# EAGLE design ActiveElectrode (EAGLE 5.01)
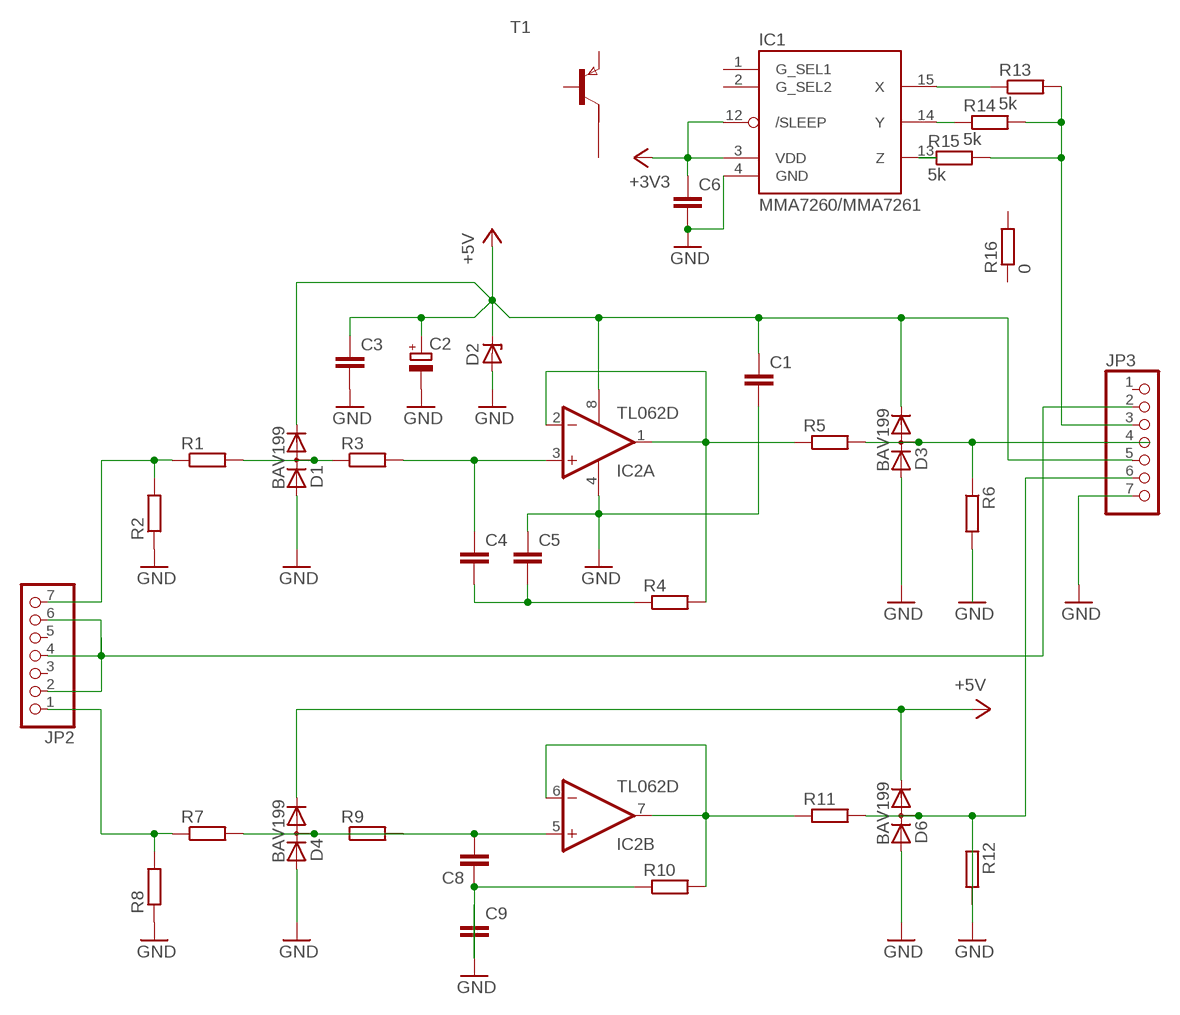
[diagram p0: schematic, sheet 1]

## Parts
C1  C-EUC0603  [C0603]
C2  CPOL-EUB/3528-21R  [B/3528-21R]
C3  C-EUC0603  [C0603]
C4  C-EUC0603  [C0603]
C5  C-EUC0603  [C0603]
C6  C-EUC0603  [C0603]
C8  C-EUC0603  [C0603]
C9  C-EUC0603  [C0603]
D1  BAV199  [SOT23]
D2  ZENER-DIODESOD80C  [SOD80C]
D3  BAV199  [SOT23]
D4  BAV199  [SOT23]
D6  BAV199  [SOT23]
IC1  MMA7260/MMA7261  [QFN16-HS]
IC2  TL062D  [SO08]
JP2  PINHD-1X7  [1X07]
JP3  PINHD-1X7  [1X07]
R1  R-EU_R0603  [R0603]
R2  R-EU_R0603  [R0603]
R3  R-EU_R0603  [R0603]
R4  R-EU_R0603  [R0603]
R5  R-EU_R0603  [R0603]
R6  R-EU_R0603  [R0603]
R7  R-EU_R0603  [R0603]
R8  R-EU_R0603  [R0603]
R9  R-EU_R0603  [R0603]
R10  R-EU_R0603  [R0603]
R11  R-EU_R0603  [R0603]
R12  R-EU_R0603  [R0603]
R13  5k  R-EU_R0603  [R0603]
R14  5k  R-EU_R0603  [R0603]
R15  5k  R-EU_R0603  [R0603]
R16  0  R-EU_M3216  [M3216]
T1  PNPSOT23-6  [SOT23-6]

## Nets
+3V3: C6.1 IC1.3(VDD) IC1.12(/SLEEP)
+5V: C1.1 C2.+ C3.1 D1.2(C) D2.C D3.2(C) D4.2(C) D6.2(C) IC2.8(P:V+) JP3.5
N$1: D1.3(AC) R1.2 R3.1
N$2: JP2.7 R1.1 R2.2
N$3: D3.3(AC) R5.2 R6.1
N$4: C4.1 IC2.3(A:+IN) R3.2
N$5: C4.2 C5.2 R4.1
N$6: IC2.1(A:OUT) IC2.2(A:-IN) R4.2 R5.1
N$7: C1.2 C2.- C3.2 C5.1 C6.2 C9.1 D1.1(A) D2.A D3.1(A) D4.1(A) D6.1(A) IC1.4(GND) IC2.4(P:V-) JP3.7 R2.1 R6.2 R8.1 R12.1 ; supply symbol labelled GND
N$8: D4.3(AC) R7.2 R9.2
N$9: C8.2 IC2.5(B:+IN) R9.1
N$10: C8.1 C9.2 R10.1
N$11: IC1.13(Z) R15.1
N$12: D6.3(AC) JP3.6 R11.2 R12.2
N$14: IC1.14(Y) R14.1
N$15: IC2.6(B:-IN) IC2.7(B:OUT) R10.2 R11.1
N$16: JP3.3 R13.2 R14.2 R15.2
N$17: IC1.15(X) R13.1
N$18: JP2.1 R7.1 R8.2
N$22: JP2.2 JP2.4 JP2.6 JP3.2
Unconnected: IC1.1(G_SEL1) IC1.2(G_SEL2) JP2.3 JP2.5 JP3.1 JP3.4 R16.1 R16.2 T1.1(C) T1.2(C1) T1.3(B) T1.4(E) T1.5(C2) T1.6(C3)

## Library data of the parts
C1 C3-C6 C8 C9 = rcl:C-EU: CAPACITOR, European symbol
C2 = rcl:CPOL-EU: POLARIZED CAPACITOR, European symbol
D1 D3 D4 D6 = diode:BAV199: DIODE low-leakage double diode
D2 = diode:ZENER-DIODE: Z-Diode
IC1 = mma7260_7261:MMA7260/MMA7261
IC2 = linear:TL062: OP AMP
JP2 JP3 = pinhead:PINHD-1X7: PIN HEADER
R1-R16 = rcl:R-EU_: RESISTOR, European symbol
T1 = zetex:PNPSOT23-6: PNP TRANSISTOR

## Board
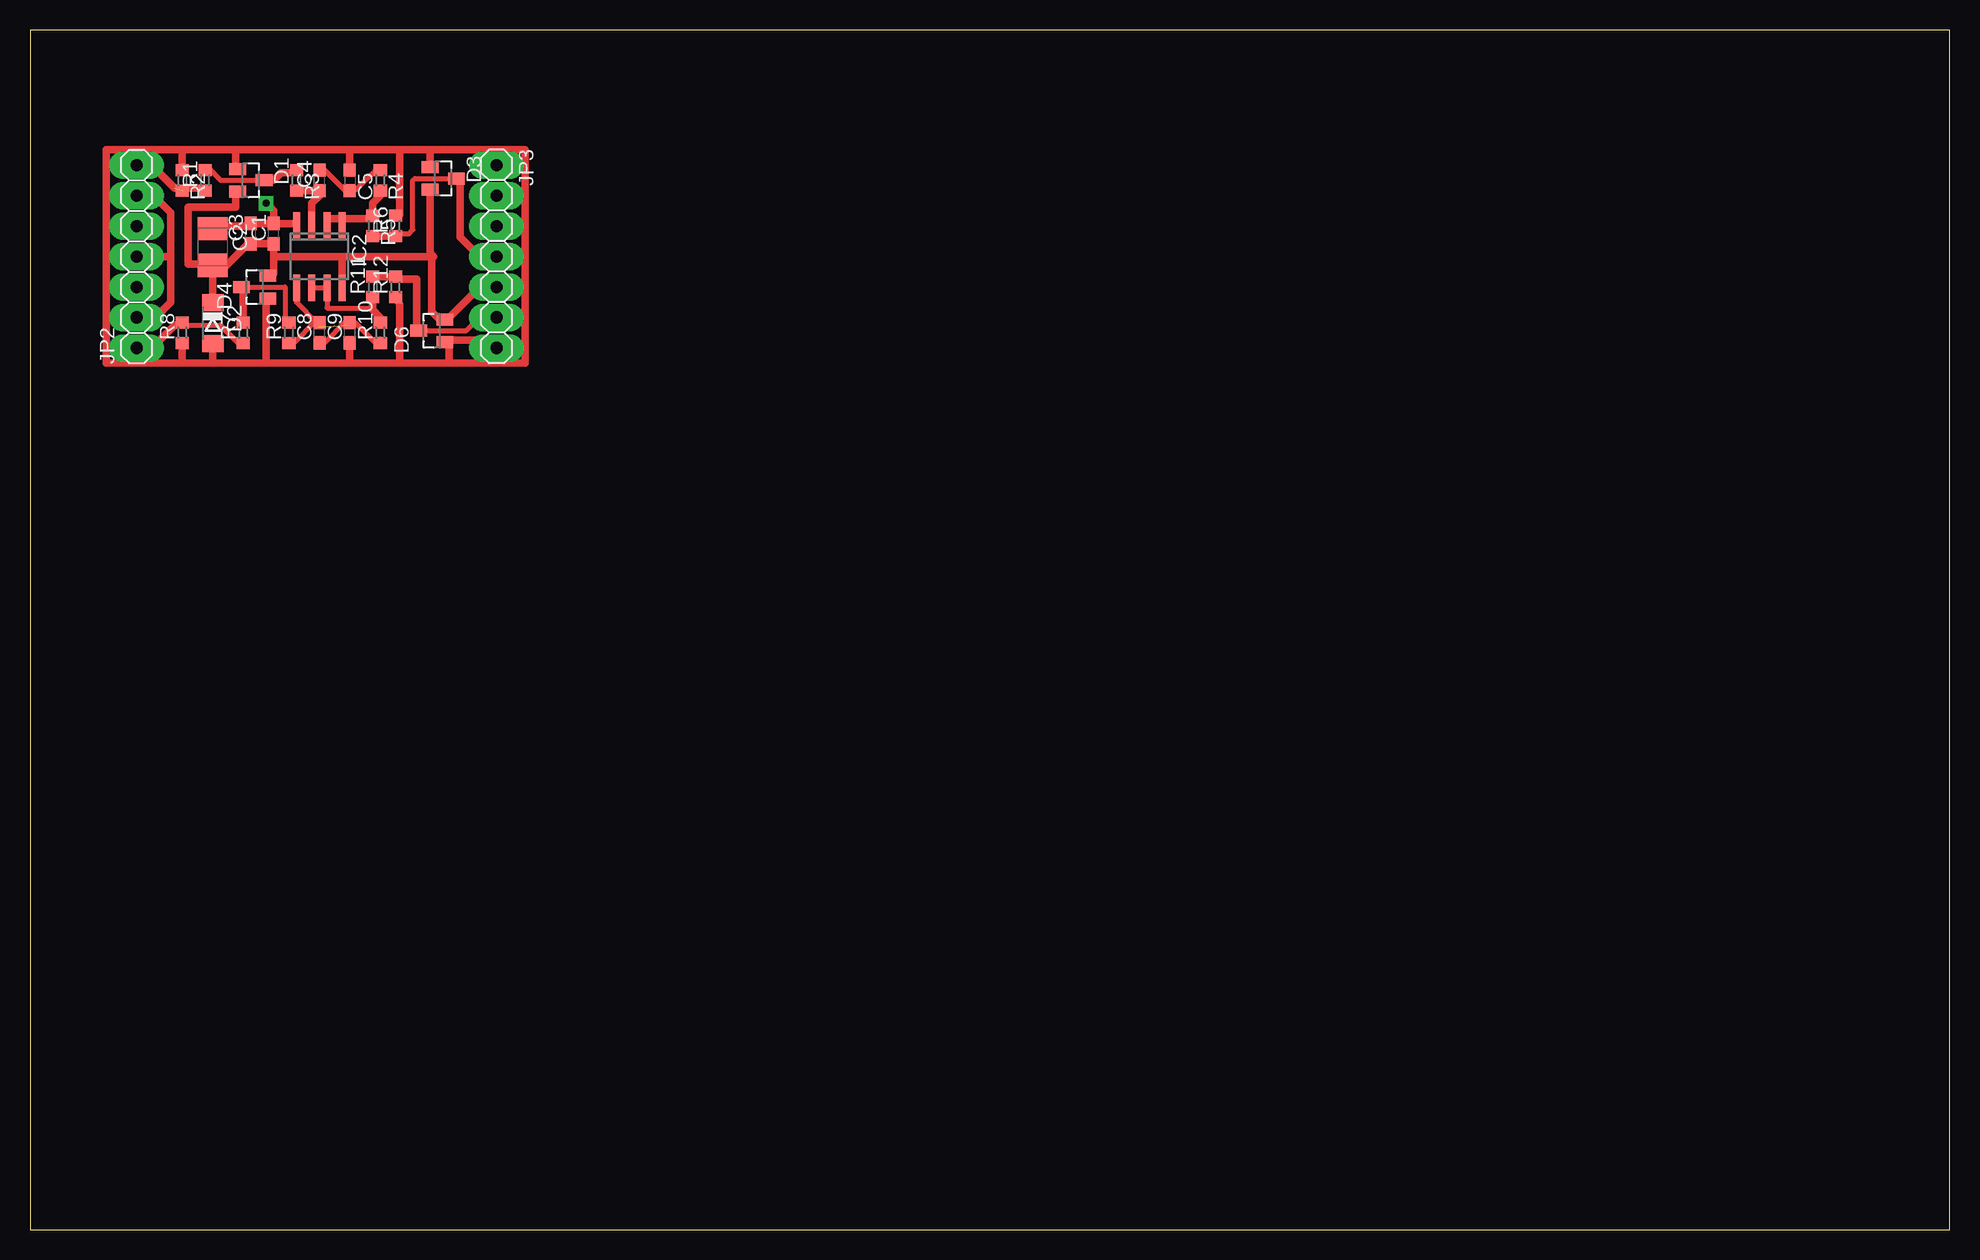
[diagram p1: board, top side]
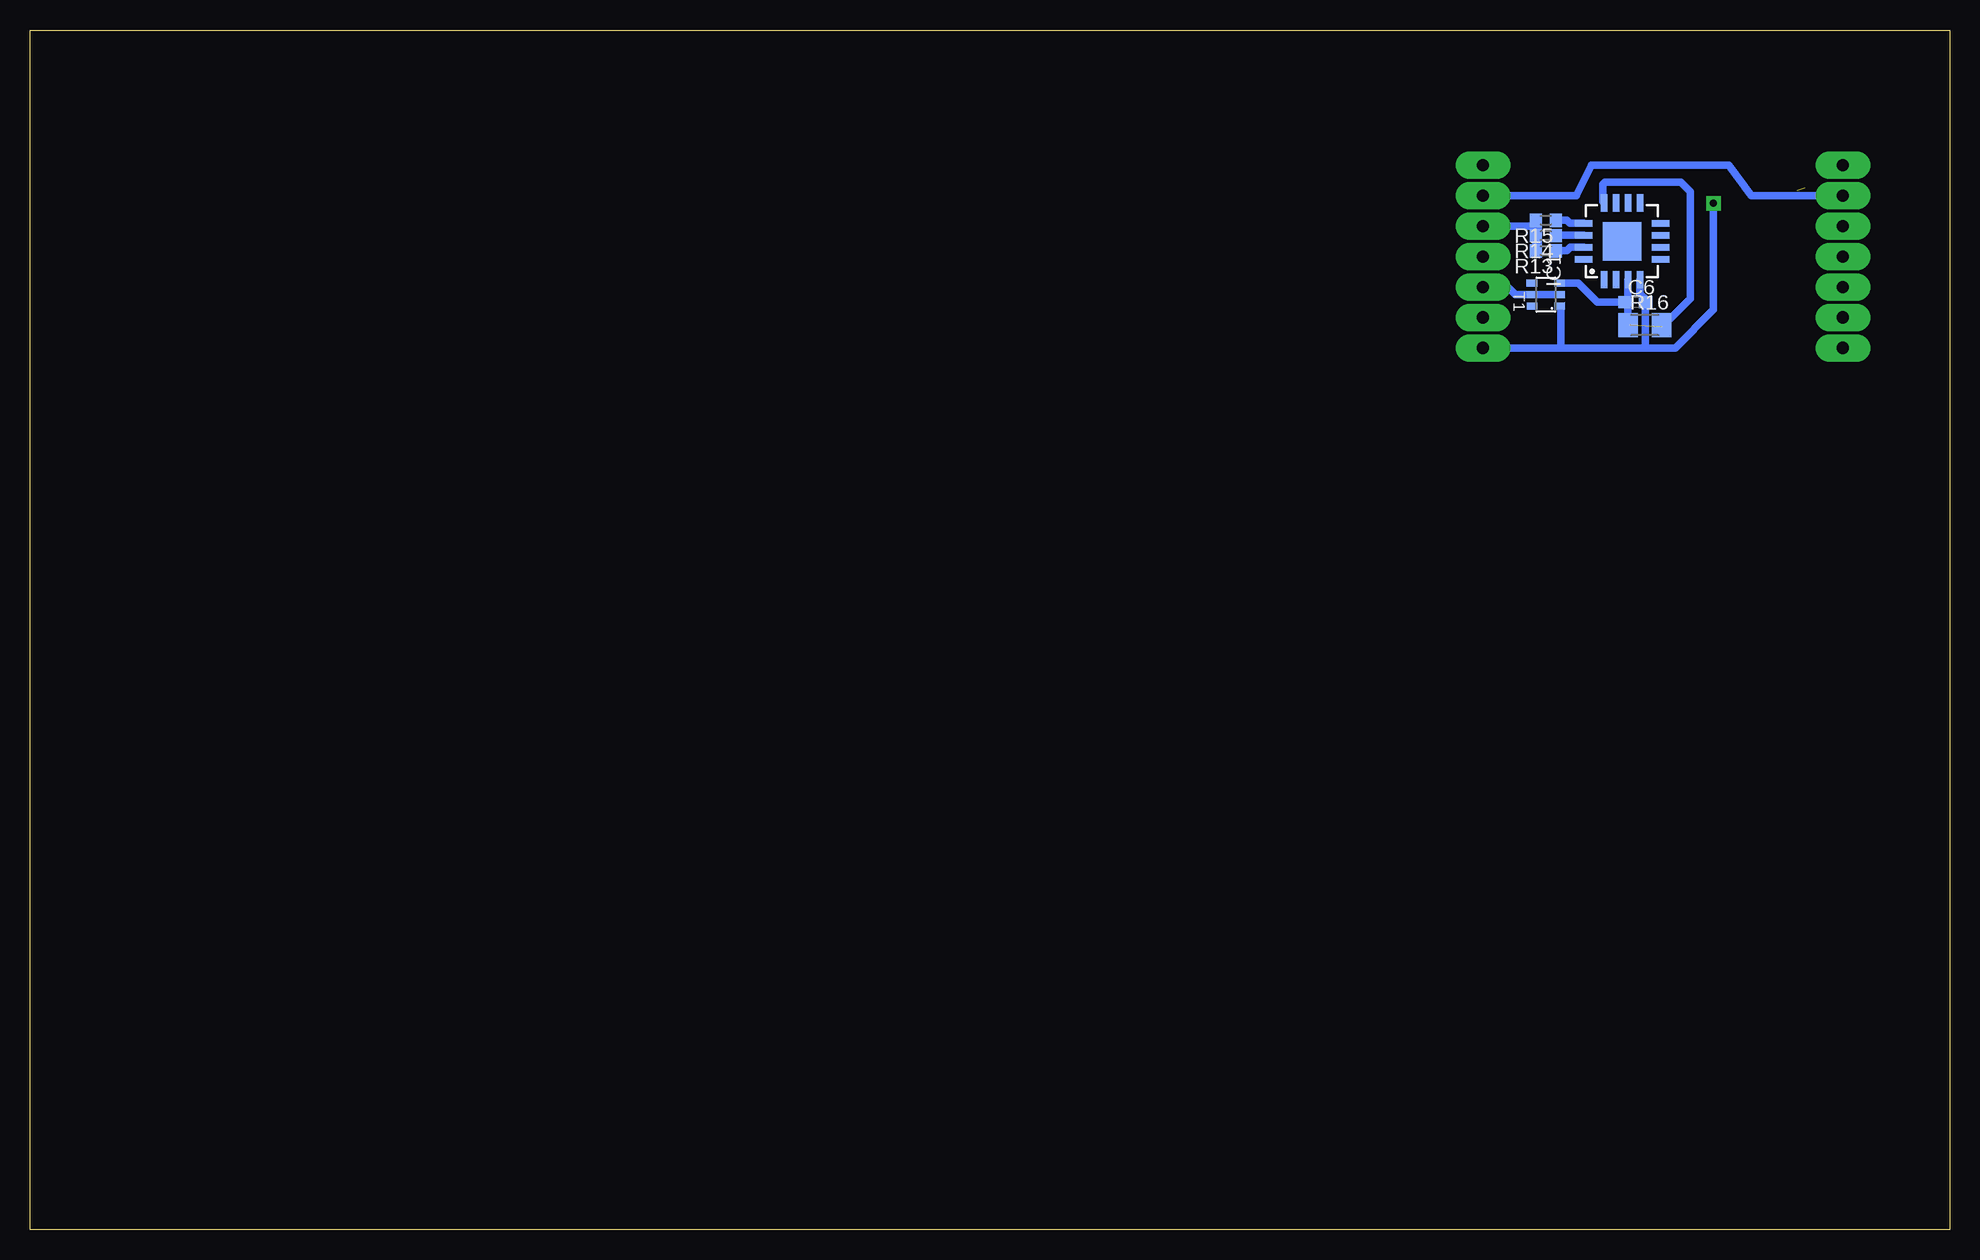
[diagram p2: board, bottom side, seen from below]

Size 160 x 100 mm. Coordinates in mm from the lower left corner, seen from the top.
Outline: 0,0 160,0 160,100 0,100 0,0
Copper layers (1*16): Top 0.035mm / dielectric 1.5mm / Bottom 0.035mm
Design rules "default": minimum track width 10mil, minimum drill 32mil, track to track 12mil, track to pad 12mil, pad to pad 12mil, via to via 12mil, smd to smd 8mil, copper to edge 40mil, drill to drill 40mil, minimum pad ring 25mil, minimum via ring 12mil, stop-mask expansion 4mil, vias tented up to drill 0mil, thermal gap 10mil

### Footprints (pad centres in the part's own frame; a part is rotated, then mirrored left to right if it is on the bottom)
C0603 = smd 1.1 x 1: 1 -0.85,0; 2 0.85,0
B/3528-21R = smd 1.95 x 2.5: + 1.525,0; - -1.525,0
SOT23 = smd 1 x 1.4: 1 -0.95,-1.1; 2 0.95,-1.1; 3 0,1.1
SOD80C = smd 1.4 x 1.8: A 1.7,0; C -1.7,0
QFN16-HS = smd 1.45 x 0.55: 1 -3.2,1.5; 2 -3.2,0.5; 3 -3.2,-0.5; 4 -3.2,-1.5; 9 3.2,-1.5; 10 3.2,-0.5; 11 3.2,0.5; 12 3.2,1.5 | smd 0.55 x 1.45: 5 -1.5,-3.2; 6 -0.5,-3.2; 7 0.5,-3.2; 8 1.5,-3.2; 13 1.5,3.2; 14 0.5,3.2; 15 -0.5,3.2; 16 -1.5,3.2 | smd 3.2 x 3.2: 17 0,0
SO08 = smd 0.6 x 2.2: 1 -1.905,-2.6; 2 -0.635,-2.6; 3 0.635,-2.6; 4 1.905,-2.6; 5 1.905,2.6; 6 0.635,2.6; 7 -0.635,2.6; 8 -1.905,2.6
1X07 = drill 1.016 long: 1 -7.62,0; 2 -5.08,0; 3 -2.54,0; 4 0,0; 5 2.54,0; 6 5.08,0; 7 7.62,0
R0603 = smd 1 x 1.1: 1 -0.85,0; 2 0.85,0
M3216 = smd 1.6 x 2: 1 -1.4,0; 2 1.4,0
SOT23-6 = smd 0.6 x 0.9: 1 -0.95,-1.15; 2 0,-1.15; 3 0.95,-1.15; 4 0.95,1.15; 5 0,1.15; 6 -0.95,1.15

### Placement (x,y rotation side)
C1  20.31,83.02 90 top
C2  15.24,81.91 270 top
C3  18.41,83.02 90 top
C4  24.12,87.47 90 top
C5  26.66,87.47 270 top
C6  26.19,77.3 0 bottom
C8  24.12,74.77 90 top
C9  26.66,74.77 90 top
D1  18.41,87.47 270 top
D2  15.24,75.56 270 top
D3  34.44,87.62 270 top
D4  18.73,78.58 90 top
D6  33.49,74.92 90 top
IC1  27.3,82.39 90 bottom
IC2  24.12,81.11 180 top
JP2  8.89,81.11 90 top
JP3  38.89,81.11 270 top
R1  14.6,87.47 90 top
R2  12.7,87.47 270 top
R3  22.22,87.47 270 top
R4  29.2,87.47 270 top
R5  28.57,83.66 270 top
R6  30.47,83.66 90 top
R7  17.77,74.77 90 top
R8  12.7,74.77 90 top
R9  21.58,74.77 90 top
R10  29.2,74.77 90 top
R11  28.57,78.58 90 top
R12  30.47,78.58 90 top
R13  33.65,81.59 180 bottom
R14  33.65,82.86 180 bottom
R15  33.65,84.13 180 bottom
R16  25.39,75.4 0 bottom
T1  33.65,77.94 90.1 bottom

### Tracks (layer width: path | path; a pad name or v marks a point on that pad's centre or on a via)
+3V3  (1 unrouted)
  Bottom 0.61: C6.1 27.04,77.41 26.8,77.65 IC1.3 26.8,75.53 26.66,75.4 | IC1.12 28.89,85.67 28.89,87.15 28.73,87.31 22.38,87.31 21.58,86.51 21.58,77.62 23.97,75.24 | 23.97,75.24
+5V
  Top 0.61: 20.31,81.11 26.03,81.11 | 26.03,81.11 IC2.8 | 20.31,81.11 C1.1 20.31,82.39 20.1,82.17 C3.1 18.41,82.39 15.87,79.84 15.24,80.48 C2.+ | D4.2 20.31,79.69 20.31,81.11 | D1.2 17.14,86.34 17.14,85.24 13.17,85.24 13.17,80.48 14.92,80.48 15.24,80.16 C2.+ | D2.C C2.+ | 26.03,81.11 33.65,81.11 | 33.65,81.11 33.49,80.96 33.49,76.51 34.13,75.87 D6.2 34.76,75.87 37.46,78.58 JP3.5 | D3.2 33.34,81.42 33.65,81.11
N$1
  Top 0.406: D1.3 15.87,87.47 14.92,88.42 14.92,88.58 14.66,88.31 R1.2
  Top 0.61: D1.3 20.31,87.47 20.95,88.1 22.22,88.1 R3.1
N$2  (1 unrouted)
  Top 0.61: JP2.7 10.16,88.73 12.06,86.83 14.6,86.83 R1.1
N$3
  Top 0.406: 30.47,83.02 31.59,83.02 31.9,83.34 31.9,87.47 32.06,87.62 D3.3 35.86,87.77
  Top 0.61: R6.1 30.47,83.02 30.26,82.8 R5.2 | 35.86,87.77 35.86,82.71 37.46,81.11 38.73,81.11
N$4
  Top 0.61: R3.2 23.91,86.61 24.12,86.83 C4.1 24.12,86.19 23.49,85.56 IC2.3
N$5
  Top 0.406: C4.2 24.54,88.31 26.35,86.51 26.45,86.61 C5.2 26.77,86.61 26.82,86.67 27.14,86.67 29.05,88.58 29.05,88.47 R4.1
N$6
  Top 0.61: IC2.2 24.76,84.29 26.03,84.29 | 26.03,83.66 IC2.1 26.03,84.29 | 26.03,84.29 28.57,84.29 R5.1 28.57,85.56 29.2,86.19 R4.2
N$7  (via drill 0.6)
  Top 0.61: 12.7,90 6.34,90 6.34,72.22 12.7,72.22 | 12.7,90 17.14,90 | 27.3,90 30.79,90 | 27.3,90 26.66,90 C5.1 | 30.79,90 32.38,90 | 32.38,90 41.27,90 41.27,73.5 | 12.7,72.22 15.24,72.22 | 15.24,72.22 19.68,72.22 | 19.68,72.22 26.66,72.22 | 26.66,72.22 30.79,72.22 | 30.79,72.22 34.92,72.22 | 34.92,72.22 41.27,72.22 41.27,73.5 | 12.7,90 R2.1 | D1.1 arc-90 17.14,88.58 17.14,90 | C1.2 20.31,83.66 | v19.68,85.56 20.31,84.92 C1.2 | IC2.4 22.22,83.66 22,83.87 C1.2 | 18.41,83.66 C3.2 | C1.2 18.62,83.87 18.41,83.66 | D4.1 19.68,77.16 19.68,72.22 | C2.- 15.24,83.66 18.41,83.66 | 15.24,72.22 D2.A | 12.7,72.22 R8.1 | 26.66,72.22 C9.1 | R12.1 30.79,77.09 30.79,72.22 | 34.92,72.22 34.92,73.64 D6.1 34.44,74.13 | 30.79,90 30.79,84.82 R6.2 30.69,84.5 30.79,84.61 | 41.27,73.5 JP3.7 38.25,74.13 34.44,74.13 | D3.1 33.34,89.99 32.38,90 | 17.14,90 27.3,90 | 34.44,74.13 34.29,74.13
  Bottom 0.61: 32.38,76.99 32.38,73.5 33.02,73.5 | 33.02,73.5 38.73,73.5 | JP3.7 39.37,73.5 | 25.39,73.5 22.86,73.5 19.68,76.67 v19.68,85.56 | 25.39,73.5 33.02,73.5 | IC1.4 25.8,78.03 25.24,77.46 25.34,77.36 C6.2 25.34,73.55 25.39,73.5 | 38.73,73.5 JP3.7 | JP3.7 38.73,73.5
N$8
  Top 0.406: D4.3 21.27,78.58 21.27,75.72 21.37,75.61 R9.2
  Top 0.61: D4.3 17.77,78.58 R7.2
N$9
  Top 0.406: R9.1 22,73.91 23.81,75.72 23.91,75.61 | 23.91,75.61 C8.2 | 23.91,75.61 22.22,77.3 IC2.5 22.22,78.58
N$10
  Top 0.406: C8.1 24.54,73.91 26.35,75.72 26.45,75.61 C9.2 27.08,75.61 28.89,73.81 28.99,73.91 R10.1
  Top 0.61: R10.1 29.2,74.13
N$11
  Bottom 0.61: IC1.13 31.66,83.89 31.9,84.13 R15.1 32.86,84.13
N$12
  Top 0.406: D6.3 36.35,74.92 37.46,76.03 JP3.6
  Top 0.61: 30.47,79.21 R12.2 | R11.2 30.26,79.42 30.47,79.21 | 30.47,79.21 32.22,79.21 32.22,74.92 D6.3
N$13
  Bottom 0.61: 32.38,77.94 36.19,77.94 36.83,78.58 39.05,78.58
N$14
  Bottom 0.61: 32.88,82.89 32.86,82.86 R14.1 | IC1.14 32.88,82.89 | 32.88,82.89 33.02,83.02
N$15
  Top 0.406: IC2.6 24.7,78.52 24.76,78.58 IC2.7 24.76,76.83 28.41,76.83 28.57,76.67 | R10.2 29.2,75.72
  Top 0.61: R11.1 28.57,76.67 29.2,76.03 R10.2
N$16
  Bottom 0.61: 34.44,84.13 34.29,84.29 | 34.44,84.13 R15.2 | R13.2 R14.2 | R14.2 34.5,84.08 | 34.5,84.08 34.44,84.13 | 34.29,83.66 JP3.3 | R14.2 34.5,83.44 34.29,83.66 | 34.29,81.75 34.29,83.02 34.29,83.66 | 34.29,83.66 34.5,83.87 34.5,84.08
N$17
  Bottom 0.61: IC1.15 31.61,81.89 31.9,81.59 R13.1 32.86,81.59
N$18
  Top 0.406: R7.1 17.36,73.91 15.87,75.4 12.7,75.4
  Top 0.61: JP2.1 10.16,73.5 12.06,75.4 12.7,75.4 R8.2
N$22
  Top 0.61: JP2.2 10.47,76.03 11.74,77.3 11.74,81.11 | 11.74,81.11 11.74,82.07 | JP2.6 10.31,86.19 11.74,84.77 11.74,81.11 | 11.74,81.11 JP2.4
  Bottom 0.61: JP3.2 31.11,86.19 29.84,88.73 18.41,88.73 16.5,86.19 JP2.6
N$23
  Bottom 0.61: 30.95,78.89 | 30.95,78.89 32.38,78.89 | 27.3,77.3 29.36,77.3 30.95,78.89